# EAGLE design mfrhp (EAGLE 7.7.0)
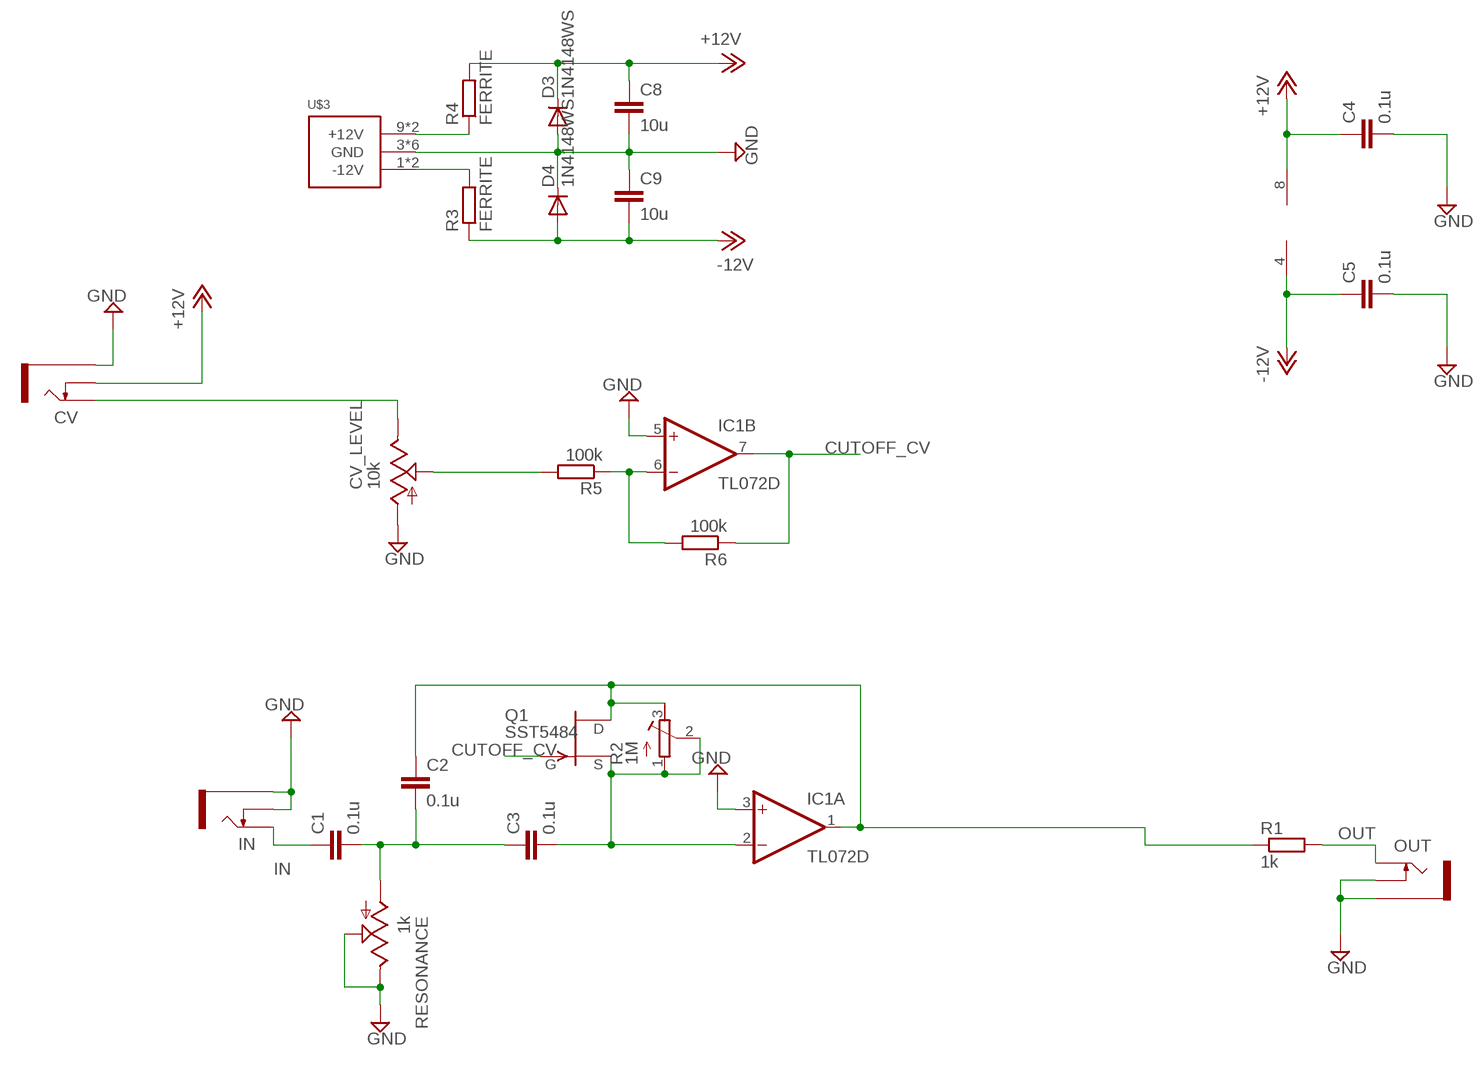
[diagram p0: schematic, sheet 1]

## Parts
C1  0.1u  C-EUC0805  [C0805]
C2  0.1u  C-EUC0805  [C0805]
C3  0.1u  C-EUC0805  [C0805]
C4  0.1u  C-EUC0805  [C0805]
C5  0.1u  C-EUC0805  [C0805]
C8  10u  C-EUC0805  [C0805]
C9  10u  C-EUC0805  [C0805]
CV  THONKICONNNEW  [WQP-PJ301M-12_JACK]
CV_LEVEL  10k  9MM_SNAP-IN_POT_  [9MM_SNAP-IN_POT]
D3  1N4148WS  DIODE-SOD323-W  [SOD323-W]
D4  1N4148WS  DIODE-SOD323-W  [SOD323-W]
IC1  TL072D  [SO08]
IN  THONKICONNNEW  [WQP-PJ301M-12_JACK]
OUT  THONKICONNNEW  [WQP-PJ301M-12_JACK]
Q1  SST5484  [SOT23]
R1  1k  R-EU_R0805  [R0805]
R2  1M  R-TRIMM3296W  [RTRIM3296W]
R3  FERRITE  R-EU_R0805  [R0805]
R4  FERRITE  R-EU_R0805  [R0805]
R5  100k  R-EU_R0805  [R0805]
R6  100k  R-EU_R0805  [R0805]
RESONANCE  1k  9MM_SNAP-IN_POT_  [9MM_SNAP-IN_POT]
U$3  POWER_SIMPLE10  [POWER_10]

## Nets
+12V: C4.1 C8.1 CV.P$2_SWITCH(SWITCH) D3.C IC1.8(P:V+) R4.2
-12V: C5.1 C9.2 D4.A IC1.4(P:V-) R3.1
CUTOFF_CV: IC1.7(B:OUT) Q1.3(G) R6.1
GND: C4.2 C5.2 C8.2 C9.1 CV.P$3_SLEEVE(SLEEVE) CV_LEVEL.1(A) D3.A D4.C IC1.3(A:+IN) IC1.5(B:+IN) IN.P$2_SWITCH(SWITCH) IN.P$3_SLEEVE(SLEEVE) OUT.P$2_SWITCH(SWITCH) OUT.P$3_SLEEVE(SLEEVE) RESONANCE.2(S) RESONANCE.3(E) U$3.3(GND) U$3.4(GND) U$3.5(GND) U$3.6(GND) U$3.7(GND) U$3.8(GND)
IN: C1.1 IN.P$1_TIP(TIP)
N$1: R3.2 U$3.1(-12V) U$3.2(-12V)
N$2: C3.2 IC1.2(A:-IN) Q1.2(S) R2.1(A) R2.2(S)
N$3: C1.2 C2.2 C3.1 RESONANCE.1(A)
N$4: R4.1 U$3.9(+12V) U$3.10(+12V)
N$5: IC1.6(B:-IN) R5.1 R6.2
N$7: CV_LEVEL.2(S) R5.2
N$8: CV.P$1_TIP(TIP) CV_LEVEL.3(E)
N$9: C2.1 IC1.1(A:OUT) Q1.1(D) R1.1 R2.3(E)
OUT: OUT.P$1_TIP(TIP) R1.2

## Library data of the parts
C1-C5 C8 C9 = rcl:C-EU: CAPACITOR, European symbol
CV IN OUT = MusicThingModular:THONKICONN: 3.5mm socket for Eurorack modular synths
CV_LEVEL RESONANCE = MusicThingModular:9MM_SNAP-IN_POT: 9mm vertical snap-in pot, Alpha / Panasonic style
D3 D4 = diode:DIODE-: DIODE
IC1 = linear:TL072: OP AMP
Q1 = transistor-fet:?548*: N-Channel JFETs Source: VISHAY 2N5484.pdf Compatible: TO92 2N5245 J304 J305 U310 J308 J309 J310 TO72 2N4416 2N4416A 2N3823 2N4351 3N169 3N170 3N171 MFE3002 TO18 2N3796 2N3797 MFE825 Source: Motorola European Master Guide Pacge 3-59
R1 R3-R6 = rcl:R-EU_: RESISTOR, European symbol
R2 = rcl:R-TRIMM: Trimm resistor
U$3 = eurorack:POWER_SIMPLE

## Board
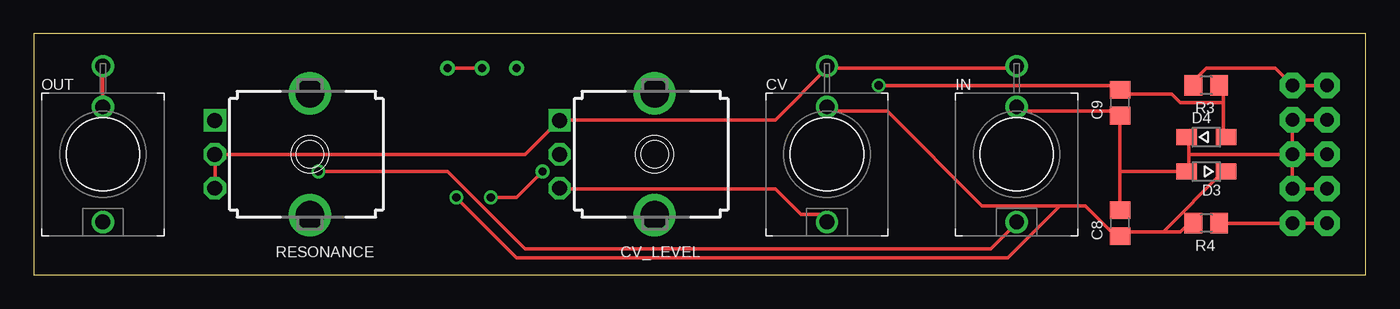
[diagram p1: board, top side]
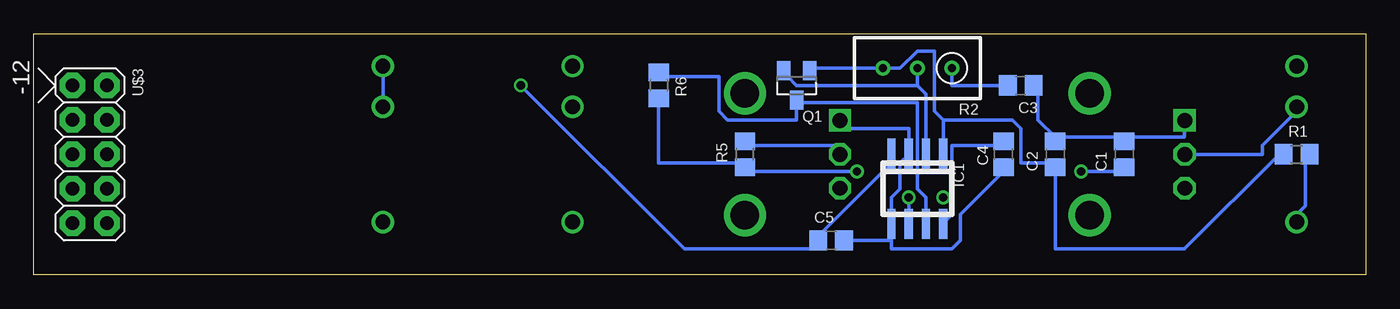
[diagram p2: board, bottom side, seen from below]

Size 98.09 x 17.77 mm. Coordinates in mm from the lower left corner, seen from the top.
Outline: 0,0 98.09,0 98.09,17.77 0,17.77 0,0
Copper layers (1*16): Top 0.035mm / dielectric 1.5mm / Bottom 0.035mm
Design rules "default": minimum track width 10mil, minimum drill 24mil, track to track 8mil, track to pad 8mil, pad to pad 8mil, via to via 8mil, smd to smd 8mil, copper to edge 40mil, drill to drill 8mil, minimum pad ring 10mil, minimum via ring 8mil, stop-mask expansion 4mil, vias tented up to drill 0mil, thermal gap 10mil

### Footprints (pad centres in the part's own frame; a part is rotated, then mirrored left to right if it is on the bottom)
C0805 = smd 1.3 x 1.5: 1 -0.95,0; 2 0.95,0
WQP-PJ301M-12_JACK = drill 1.1: P$1_TIP 0,5; P$2_SWITCH 0,-3.5; P$3_SLEEVE 0,-6.5
9MM_SNAP-IN_POT = drill 1.1 square: 1 -2.5,-7 | drill 1.1 octagon: 2 0,-7; 3 2.5,-7 | drill 2.1 pad 2.794: CHASSIS1 -4.5,0; CHASSIS2 4.5,0
SOD323-W = smd 1.5 x 1.2: A 1.45,0; C -1.45,0
SO08 = smd 0.6 x 2.2: 1 -1.905,-2.6; 2 -0.635,-2.6; 3 0.635,-2.6; 4 1.905,-2.6; 5 1.905,2.6; 6 0.635,2.6; 7 -0.635,2.6; 8 -1.905,2.6
SOT23 = smd 1 x 1.4: 1 -0.95,-1.1; 2 0.95,-1.1; 3 0,1.1
R0805 = smd 1.3 x 1.5: 1 -0.95,0; 2 0.95,0
RTRIM3296W = drill 0.61: 1 0,-2.54; 2 0,0; 3 0,2.54
POWER_10 = drill 1.016 pad 1.88 octagon: 1 -5.08,-1.27; 2 -5.08,1.27; 3 -2.54,-1.27; 4 -2.54,1.27; 5 0,-1.27; 6 0,1.27; 7 2.54,-1.27; 8 2.54,1.27; 9 5.08,-1.27; 10 5.08,1.27

### Placement (x,y rotation side)
C1  17.78,8.89 90 bottom
C2  22.86,8.89 90 bottom
C3  25.4,13.97 180 bottom
C4  26.67,8.89 270 bottom
C5  39.37,2.54 0 bottom
C8  80.01,3.81 90 top
C9  80.01,12.7 90 top
CV  58.42,8.89 180 top
CV_LEVEL  45.72,8.89 270 top
D3  86.36,7.62 180 top
D4  86.36,10.16 0 top
IC1  33.02,6.35 180 bottom
IN  72.39,8.89 180 top
OUT  5.08,8.89 180 top
Q1  41.91,13.97 180 bottom
R1  5.08,8.89 0 bottom
R2  33.02,15.24 90 bottom
R3  86.36,13.97 180 top
R4  86.36,3.81 180 top
R5  45.72,8.89 90 bottom
R6  52.07,13.97 270 bottom
RESONANCE  20.32,8.89 270 top
U$3  93.98,8.89 270 bottom

### Tracks (layer width: path | path; a pad name or v marks a point on that pad's centre or on a via)
+12V  (via drill 0.61)
  Top 0.254: 83.19,3.17 84.45,3.17 85.09,3.81 R4.2 | 83.19,3.17 80.01,3.17 C8.1 80.01,2.54 77.47,5.08 75.56,5.08 | 83.19,3.17 87.63,7.62 D3.C | 75.56,5.08 69.85,5.08 62.87,12.06 58.42,12.06 CV.P$2_SWITCH | v31.11,5.71 35.56,1.27 71.76,1.27 75.56,5.08
  Bottom 0.254: 30.48,5.71 30.48,4.45 31.11,3.81 IC1.8 | 30.48,5.71 30.48,9.53 26.67,9.53 C4.1 | v31.11,5.71 30.48,5.71
-12V  (via drill 0.61)
  Top 0.254: 87.63,12.7 87.63,13.97 R3.1 | 87.63,12.7 87.63,10.16 D4.A | 87.63,12.7 84.45,12.7 83.82,13.34 80.01,13.34 C9.2 80.01,13.97 v62.23,13.97
  Bottom 0.254: IC1.4 34.92,8.26 40,3.17 40,2.54 C5.1 40.64,2.54 40.64,1.91 50.16,1.91 v62.23,13.97
CUTOFF_CV
  Bottom 0.254: 41.91,12.7 33.02,12.7 33.02,6.35 32.38,5.71 IC1.7 | 41.91,12.7 41.91,11.43 46.99,11.43 47.62,12.06 47.62,14.61 52.07,14.61 R6.1 | 41.91,12.7 Q1.3
GND
  Top 0.254: 13.34,8.89 13.34,6.99 RESONANCE.3 | OUT.P$3_SLEEVE OUT.P$2_SWITCH | 13.34,8.89 36.2,8.89 38.1,10.79 CV_LEVEL.1 38.73,11.43 54.61,11.43 58.42,15.24 | 13.34,8.89 RESONANCE.2 | U$3.3 U$3.4 U$3.6 | U$3.6 U$3.8 U$3.7 | U$3.6 U$3.5 | 85.09,8.89 85.09,10.16 D4.C | 85.09,8.89 85.09,7.62 D3.A 80.01,7.62 | 80.01,7.62 C9.1 80.01,12.06 72.39,12.06 IN.P$2_SWITCH | 80.01,7.62 C8.2 | 58.42,15.24 72.39,15.24 IN.P$3_SLEEVE | 85.09,8.89 U$3.6 | 58.42,15.24 CV.P$3_SLEEVE
  Bottom 0.254: RESONANCE.2 7.62,8.89 7.62,9.53 5.08,12.06 OUT.P$2_SWITCH | 34.92,2.54 C5.2 | 34.92,2.54 IC1.5 34.92,5.71 34.29,6.35 34.29,8.26 33.65,8.89 IC1.3 33.65,10.79 38.1,10.79 CV_LEVEL.1 | 34.92,2.54 34.92,1.91 30.48,1.91 29.84,2.54 29.84,4.45 26.67,7.62 C4.2 | IN.P$3_SLEEVE IN.P$2_SWITCH
IN  (via drill 0.61)
  Top 0.254: v20.96,7.62 30.48,7.62 36.2,1.91 70.48,1.91 72.39,3.81 IN.P$1_TIP
  Bottom 0.254: v20.96,7.62 17.78,7.62 C1.1
N$1
  Top 0.254: R3.2 85.73,13.97 85.73,14.61 86.36,15.24 91.44,15.24 U$3.2 U$3.1
N$2
  Top 0.254: R2.2 R2.1
  Bottom 0.254: C3.2 30.48,13.97 R2.1 | 33.02,13.97 41.91,13.97 42.54,14.61 Q1.2 | R2.2 33.02,13.97 | IC1.2 32.38,13.34 33.02,13.97
N$3
  Bottom 0.254: 22.86,10.16 24.13,11.43 24.13,13.97 C3.1 | 17.78,10.16 13.34,10.16 13.34,10.79 RESONANCE.1 | 17.78,10.16 22.86,10.16 | 22.86,10.16 C2.2 | 17.78,10.16 C1.2
N$4
  Top 0.254: R4.1 U$3.10 U$3.9
N$5  (via drill 0.61)
  Top 0.254: v33.65,5.71 35.56,5.71 v37.46,7.62
  Bottom 0.254: R6.2 52.07,8.26 45.72,8.26 R5.1 45.72,7.62 v37.46,7.62 | v33.65,5.71 IC1.6
N$7
  Bottom 0.254: R5.2 45.72,9.53 38.73,9.53 38.73,8.89 CV_LEVEL.2
N$8
  Top 0.254: CV_LEVEL.3 38.73,6.35 54.61,6.35 56.51,4.45 58.42,4.45 CV.P$1_TIP
N$9
  Bottom 0.254: Q1.1 40.64,15.24 R2.3 34.29,15.24 33.02,16.51 31.75,16.51 31.75,12.06 31.11,11.43 | 31.11,11.43 26.04,11.43 25.4,10.79 25.4,8.26 22.86,8.26 C2.1 22.86,1.91 13.34,1.91 6.35,8.89 R1.1 | IC1.1 31.11,11.43
OUT
  Bottom 0.254: R1.2 4.45,8.89 4.45,5.08 5.08,4.45 OUT.P$1_TIP